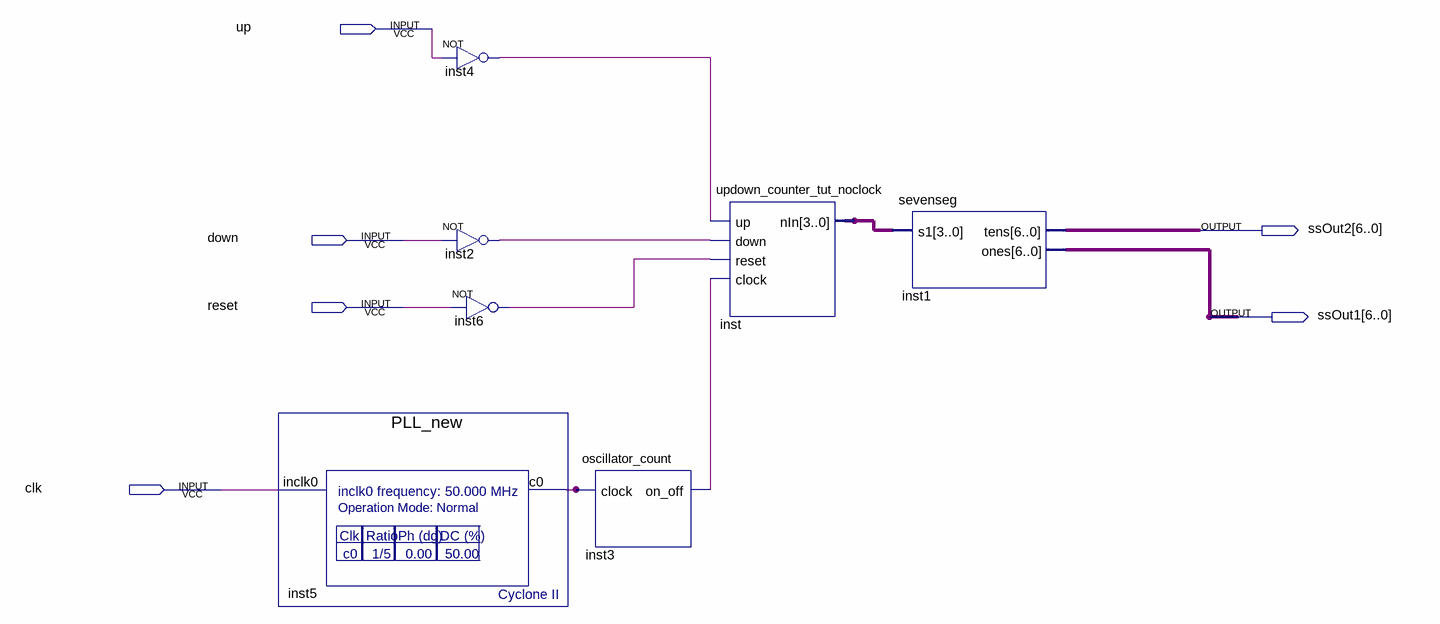
[diagram p0: schematic sheet]
// Quartus schematic BlockClock.bdf as structural Verilog: 7 symbols, 6 pins
module BlockClock (
  input  up,
  input  down,
  input  reset,
  input  clk,
  output [6:0] ssOut2,
  output [6:0] ssOut1
);

  wire inst2_out, inst3_on_off, inst4_out, inst5_c0, inst6_out;
  wire [3:0] inst_nin;

  PLL_new inst5 (.inclk0(clk), .c0(inst5_c0));
  not inst4 (inst4_out, up);
  not inst2 (inst2_out, down);
  not inst6 (inst6_out, reset);
  oscillator_count inst3 (.clock(inst5_c0), .on_off(inst3_on_off));
  updown_counter_tut_noclock inst (
    .up(inst4_out), .down(inst2_out), .reset(inst6_out), .clock(inst3_on_off), .nIn(inst_nin));
  sevenseg inst1 (.s1(inst_nin), .tens(ssOut2), .ones(ssOut1));
endmodule
